# EAGLE schematic v2 (EAGLE 8.6.0)
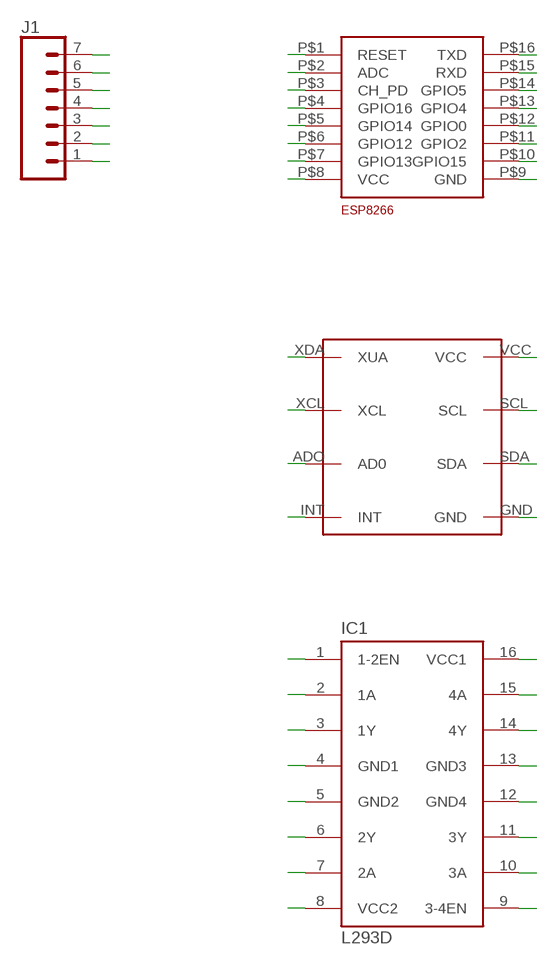
[diagram p0: schematic, sheet 1]

## Parts
IC1  L293D  [DIL16]
J1  CONN_07  [1X07]
U$1  MPU-6050  [MPU-6050]
U$2  ESP_THIAGO  [ESP_THIAGO]

## Nets
N$1: IC1.1(1-2EN)
N$2: IC1.2(1A)
N$3: IC1.3(1Y)
N$4: IC1.4(GND1)
N$5: IC1.5(GND2)
N$6: IC1.6(2Y)
N$7: IC1.7(2A)
N$8: IC1.8(VCC2)
N$9: IC1.9(3-4EN)
N$10: IC1.10(3A)
N$11: IC1.11(3Y)
N$12: IC1.12(GND4)
N$13: IC1.13(GND3)
N$14: IC1.14(4Y)
N$15: IC1.15(4A)
N$16: IC1.16(VCC1)
N$17: U$1.VCC
N$18: U$1.SCL
N$19: U$1.SDA
N$20: U$1.GND
N$21: U$1.XDA(XUA)
N$22: U$1.XCL
N$23: U$1.ADO(AD0)
N$24: U$1.INT
N$25: U$2.P$16(TXD)
N$26: U$2.P$15(RXD)
N$27: U$2.P$14(GPIO5)
N$28: U$2.P$13(GPIO4)
N$29: U$2.P$12(GPIO0)
N$30: U$2.P$11(GPIO2)
N$31: U$2.P$10(GPIO15)
N$32: U$2.P$9(GND)
N$33: U$2.P$1(RESET)
N$34: U$2.P$2(ADC)
N$35: U$2.P$3(CH_PD)
N$36: U$2.P$4(GPIO16)
N$37: U$2.P$5(GPIO14)
N$38: U$2.P$6(GPIO12)
N$39: U$2.P$7(GPIO13)
N$40: U$2.P$8(VCC)
N$41: J1.7
N$42: J1.6
N$43: J1.5
N$44: J1.4
N$45: J1.3
N$46: J1.2
N$47: J1.1

## Library data of the parts
IC1 = st-microelectronics:L293D: PUSH-PULL 4 CHANNEL DRIVER; MPN: L293D; OC_FARNELL: 9589619; OC_NEWARK: 56P8249
J1 = SparkFun-Connectors:CONN_07: Multi connection point. Often used as Generic Header-pin footprint for 0.1 inch spaced/style header connections On any of the 0.1 inch spaced packages, you can populate with these: Break Away Headers - Straight <https://www.sparkfun.com/products/116> (PRT-00116) Break Away Male Headers - Right Angle <https://www.sparkfun.com/products/553> (PRT-00553) Female Headers <https://www.sparkfun.com/products/115> (PRT-00115) Break Away Headers - Machine Pin <https://www.sparkfun.com/products/117> (PRT-00117) Break Away Female Headers - Swiss Machine Pin <https://www.sparkfun.com/products/743> (PRT-00743) For SCREWTERMINALS and SPRING TERMINALS visit here: Screw Terimnals on SparkFun.com <https://www.sparkfun.com/search/results?term=Screw+Terminals> (5mm/3.5mm/2.54mm spacing) This device is also useful as a general connection point to wire up your design to another part of your project. Our various solder wires solder well into these plated through hole pads. Hook-Up Wire - Assortment (Stranded, 22 AWG) <https://www.sparkfun.com/products/11375> (PRT-11375) Hook-Up Wire - Assortment (Solid Core, 22 AWG) <https://www.sparkfun.com/products/11367> (PRT-11367) View the entire wire category on our website here <https://www.sparkfun.com/categories/141> Special notes: Molex polarized connector foot print use with SKU : PRT-08231 with associated crimp pins and housings. 1MM SMD Version SKU: PRT-10208 NOTES ON THE VARIANTS LOCK and LOCK_LONGPADS... This footprint was designed to help hold the alignment of a through-hole component (i.e. 6-pin header) while soldering it into place. You may notice that each hole has been shifted either up or down by 0.005 of an inch from it's more standard position (which is a perfectly straight line). This slight alteration caused the pins (the squares in the middle) to touch the edges of the holes. Because they are alternating, it causes a "brace" to hold the component in place. 0.005 has proven to be the perfect amount of "off-center" position when using our standard breakaway headers. Although looks a little odd when you look at the bare footprint, once you have a header in there, the alteration is very hard to notice. Also,if you push a header all the way into place, it is covered up entirely on the bottom side.
U$1 = MPU6050:MPU-6050
U$2 = esp8266:ESP_THIAGO